# Altium schematic sheet SPI_Breakout.SchDoc
size Letter; Organization: Altium Limited; Address1: L3, 12a Rodborough Rd; Address2: Frenchs Forest; Address3: NSW; Address4: Australia 2086
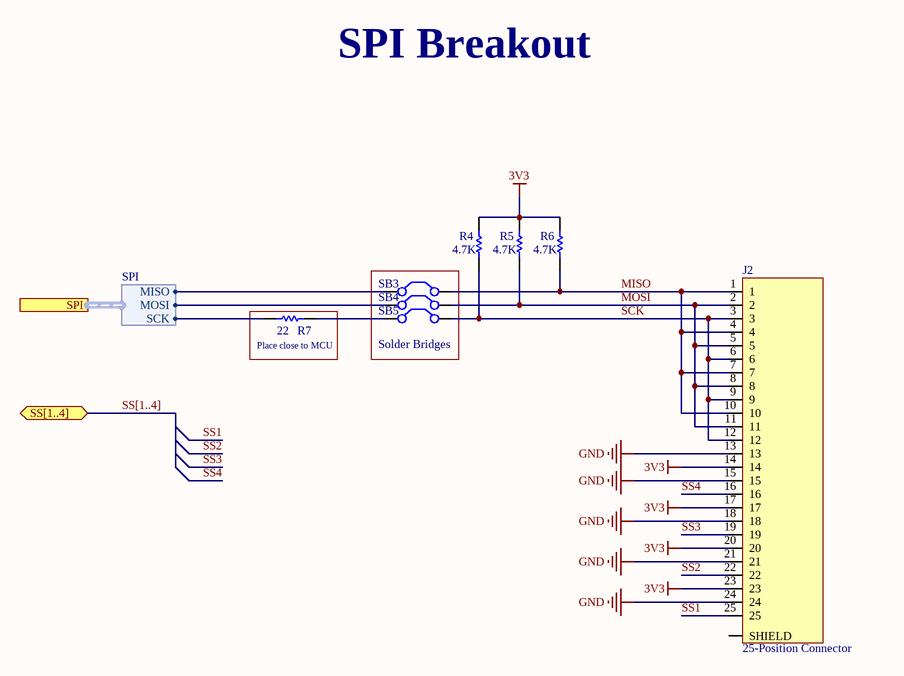
[diagram p0: SPI_Breakout.SchDoc]

## Parts
J2  25-Position Connector  [25-POS D-SUB]
R4  value 4.7K  [0402]  (hidden comment: Res1)
R5  value 4.7K  [0402]  (hidden comment: Res1)
R6  value 4.7K  [0402]  (hidden comment: Res1)
R7  value 22  [0402]  (hidden comment: Res1)
SB3  Solder Bridge  [SB-2pos]  (value not drawn)
SB4  Solder Bridge  [SB-2pos]  (value not drawn)
SB5  Solder Bridge  [SB-2pos]  (value not drawn)

## Blocks framed on the sheet
Solder Bridges: SB3-SB5
Place close to MCU: R7

## Ports
SPI (harness SPI), SS[1..4] (bidir)

## Harnesses
SPI: MISO, MOSI, SCK

## Nets
3V3: J2.14 J2.17 J2.20 J2.23 R4.1 R5.2 R6.1
GND: J2.13 J2.15 J2.18 J2.21 J2.24
MISO: J2.1 J2.4 J2.7 J2.10 R6.2 SB3.2(C2)
MOSI: J2.2 J2.5 J2.8 J2.11 R5.1 SB4.2(C2)
SCK: J2.3 J2.6 J2.9 J2.12 R4.2 SB5.2(C2)
SS1: J2.25
SS2: J2.22
SS3: J2.19
SS4: J2.16
NetR7_1: R7.1 ; port SPI.SCK
NetR7_2: R7.2 SB5.1(C1)
NetSB3_1: SB3.1(C1) ; port SPI.MISO
NetSB4_1: SB4.1(C1) ; port SPI.MOSI

Not connected (* = marked no-connect by the designer): J2 SHIELD

## Buses and harness runs
bus SS[1..4] = port SS[1..4]

## Notes on the sheet
- SPI Breakout
- Title
- Size:
- Date:
- Letter
- Number:
- Time:
- Revision:
- Sheet
- of
- File:

## Library data of the parts
J2 = 25-Position Connector: Manufacturer Part Number: 772-E25-213R051; DigiKey Part Number: NOR1066-ND
R4-R7 = Res1: Resistor
SB3-SB5 = Jumper: Jumper Wire